# EAGLE design lm317_TCV (EAGLE 7.2.0)
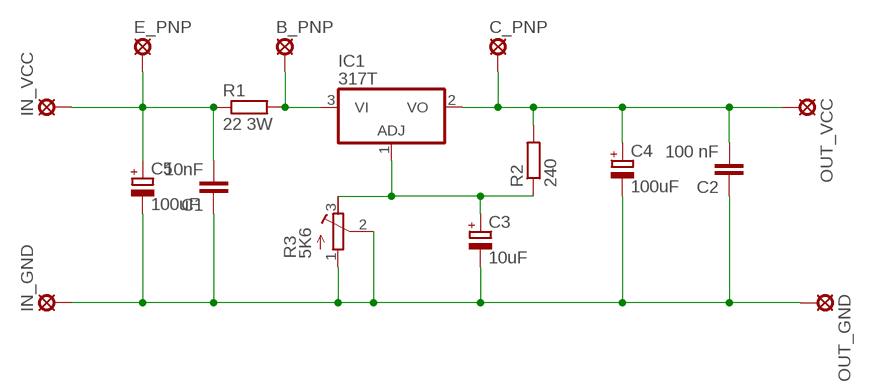
[diagram p0: schematic, sheet 1]

## Parts
B_PNP  SE14  [SE14]
C1  10nF  C7.5/3  [C7.5B3]
C2  100 nF  C7.5/3  [C7.5B3]
C3  10uF  CPOL-EUE2,5-6E  [E2,5-6E]
C4  100uF  CPOL-EUE2,5-6E  [E2,5-6E]
C5  100uF  CPOL-EUE2,5-6E  [E2,5-6E]
C_PNP  SE14  [SE14]
E_PNP  SE14  [SE14]
IC1  317T  [TO220H]
IN_GND  SE14  [SE14]
IN_VCC  SE14  [SE14]
OUT_GND  SE14  [SE14]
OUT_VCC  SE14  [SE14]
R1  22 3W  R-EU_0411/12  [0411/12]
R2  240  R-EU_0207/7  [0207/7]
R3  5K6  R-TRIMM3339P  [RTRIM3339P]

## Nets
N$1: C1.2 C5.+ E_PNP.MP IN_VCC.MP R1.1
N$2: B_PNP.MP IC1.3(VI) R1.2
N$3: C1.1 C2.1 C3.- C4.- C5.- IN_GND.MP OUT_GND.MP R3.1(A) R3.2(S)
N$4: C3.+ IC1.1(ADJ) R2.1 R3.3(E)
N$6: C2.2 C4.+ C_PNP.MP IC1.2(VO) OUT_VCC.MP R2.2

## Library data of the parts
B_PNP C_PNP E_PNP IN_GND IN_VCC OUT_GND OUT_VCC = solpad:SE14: SOLDER PAD E1553, drill 1,4mm, distributor Buerklin, 07F820
C1 C2 = capacitor-wima:C: CAPACITOR naming: grid - package width
C3-C5 = resistor:CPOL-EU: POLARIZED CAPACITOR, European symbol
IC1 = linear:*317: Positive VOLTAGE REGULATOR
R1 R2 = rcl:R-EU_: RESISTOR, European symbol
R3 = resistor:R-TRIMM: Trimm resistor

## Board
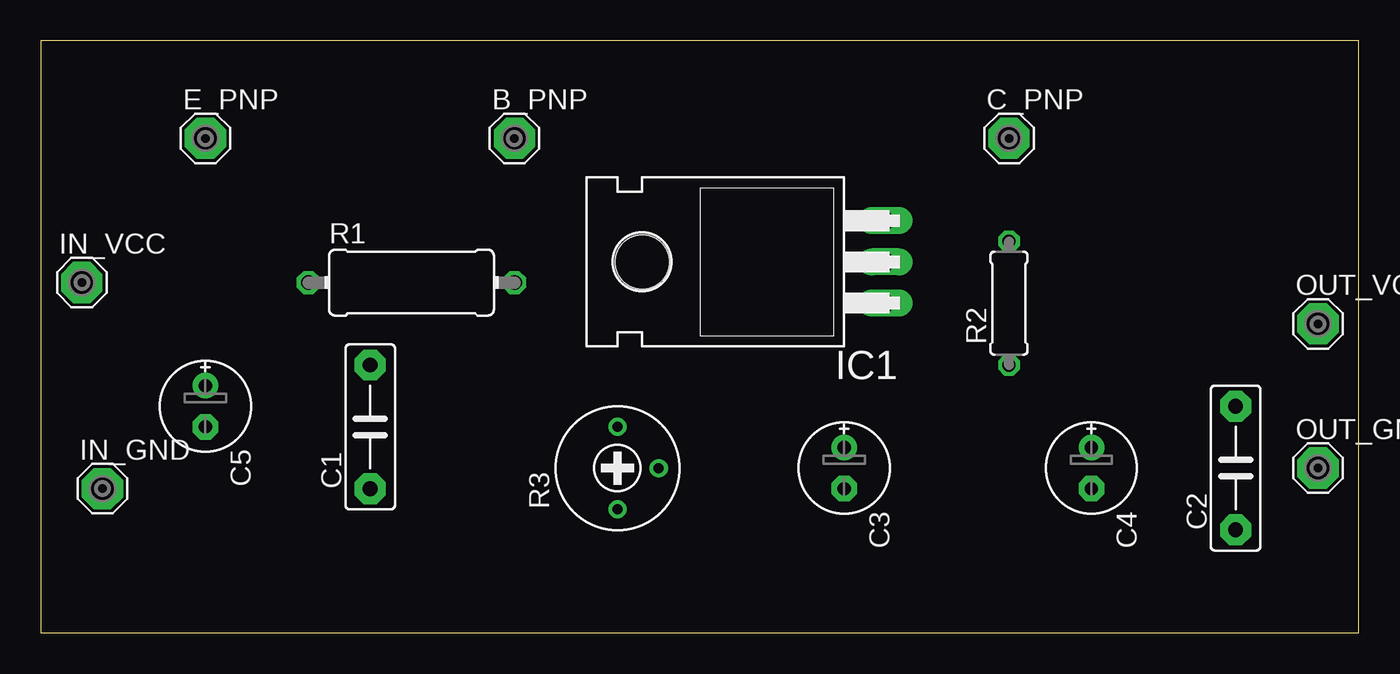
[diagram p1: board, top side]
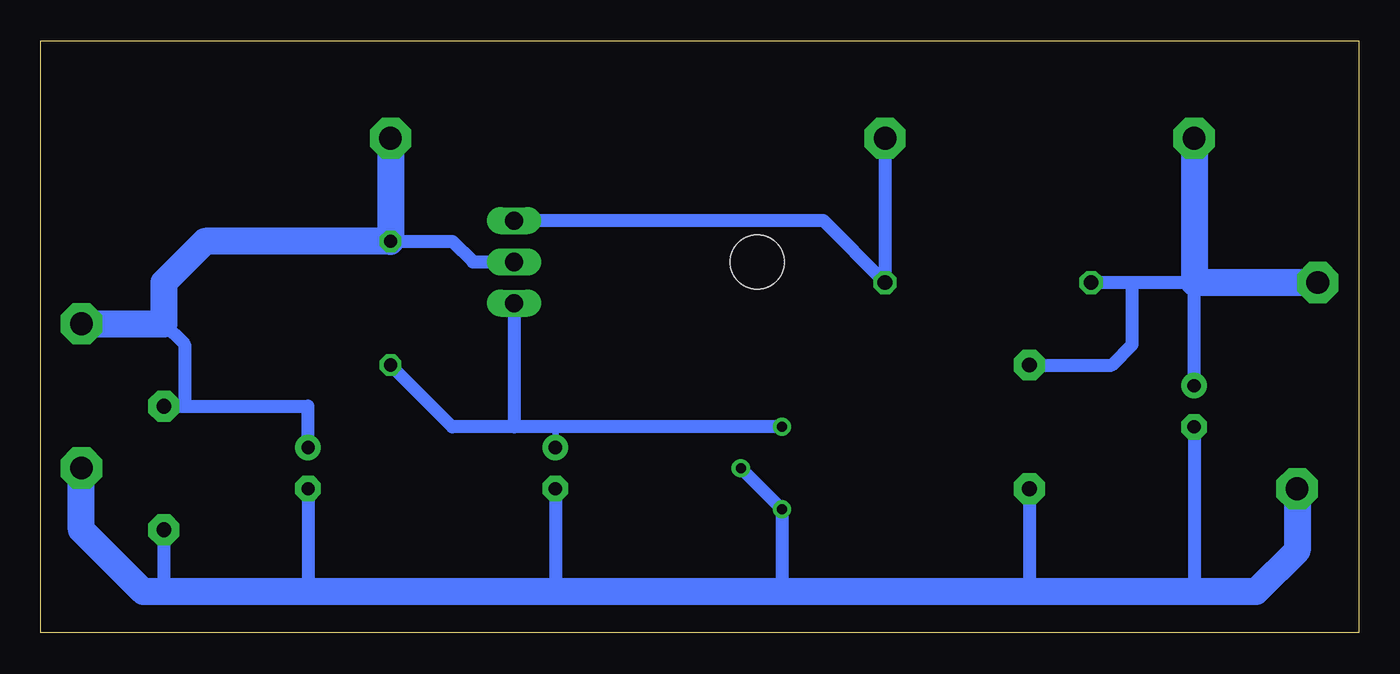
[diagram p2: board, bottom side, seen from below]

Size 81.26 x 36.5 mm. Coordinates in mm from the lower left corner, seen from the top.
Outline: 0,0 81.26,0 81.26,36.5 0,36.5 0,0
Copper layers (1*16): Top 0.035mm / dielectric 1.5mm / Bottom 0.035mm
Design rules "default": minimum track width 10mil, minimum drill 24mil, track to track 8mil, track to pad 8mil, pad to pad 8mil, via to via 8mil, smd to smd 8mil, copper to edge 40mil, drill to drill 8mil, minimum pad ring 10mil, minimum via ring 8mil, stop-mask expansion 4mil, vias tented up to drill 0mil, thermal gap 10mil

### Footprints (pad centres in the part's own frame; a part is rotated, then mirrored left to right if it is on the bottom)
SE14 = drill 1.397 pad 2.54 octagon: MP 0,0
C7.5B3 = drill 0.914 pad 1.905 octagon: 1 -3.81,0; 2 3.81,0
E2,5-6E = drill 0.813 pad 1.575: + -1.27,0 | drill 0.813 pad 1.575 octagon: - 1.27,0
TO220H = drill 1.118 long: 1 -2.54,-10.16; 2 0,-10.16; 3 2.54,-10.16 | hole 3.302: 0,4.826
0411/12 = drill 0.914 octagon: 1 -6.35,0; 2 6.35,0
0207/7 = drill 0.813 octagon: 1 -3.81,0; 2 3.81,0
RTRIM3339P = drill 0.61: 1 -2.54,0; 2 0,-2.54; 3 2.54,0

### Placement (x,y rotation side)
B_PNP  29.21,30.48 0 top
C1  20.32,12.7 90 top
C2  73.66,10.16 90 top
C3  49.53,10.16 270 top
C4  64.77,10.16 270 top
C5  10.16,13.97 270 top
C_PNP  59.69,30.48 0 top
E_PNP  10.16,30.48 0 top
IC1  41.91,22.86 90 top
IN_GND  3.81,8.89 0 top
IN_VCC  2.54,21.59 0 top
OUT_GND  78.74,10.16 0 top
OUT_VCC  78.74,19.05 0 top
R1  22.86,21.59 0 top
R2  59.69,20.32 90 top
R3  35.56,10.16 90 top

### Tracks (layer width: path | path; a pad name or v marks a point on that pad's centre or on a via)
N$1
  Bottom 0.813: 13.97,21.59 10.16,21.59 C5.+ | 13.97,21.59 R1.1 | C1.2 15.24,16.51 13.97,17.78 13.97,21.59
  Bottom 1.676: IN_VCC.MP 10.16,21.59 E_PNP.MP
N$2
  Bottom 0.813: B_PNP.MP R1.2 33.02,25.4 IC1.3
N$3
  Bottom 0.813: C5.- 10.16,2.54 | C1.1 20.32,2.54 | R3.2 R3.1 35.56,2.54 | C3.- 49.53,2.54 | C4.- 64.77,2.54 | C2.1 73.66,2.54
  Bottom 1.676: IN_GND.MP 3.81,5.08 6.35,2.54 10.16,2.54 20.32,2.54 35.56,2.54 49.53,2.54 64.77,2.54 73.66,2.54 74.93,2.54 78.74,6.35 OUT_GND.MP
N$4
  Bottom 0.406: 49.53,12.7 C3.+
  Bottom 0.813: R3.3 49.53,12.7 52.07,12.7 | 52.07,12.7 55.88,12.7 R2.1 | IC1.1 52.07,12.7
N$6
  Bottom 0.813: C4.+ 64.77,13.97 72.39,13.97 | C2.2 72.39,13.97 | R2.2 55.88,24.13 54.61,22.86 IC1.2 | 73.66,19.05 72.39,17.78 72.39,13.97
  Bottom 1.676: C_PNP.MP R2.2 71.12,24.13 73.66,21.59 73.66,19.05 OUT_VCC.MP